# Altium schematic sheet HCHO_Benchmark.SchDoc
size A2
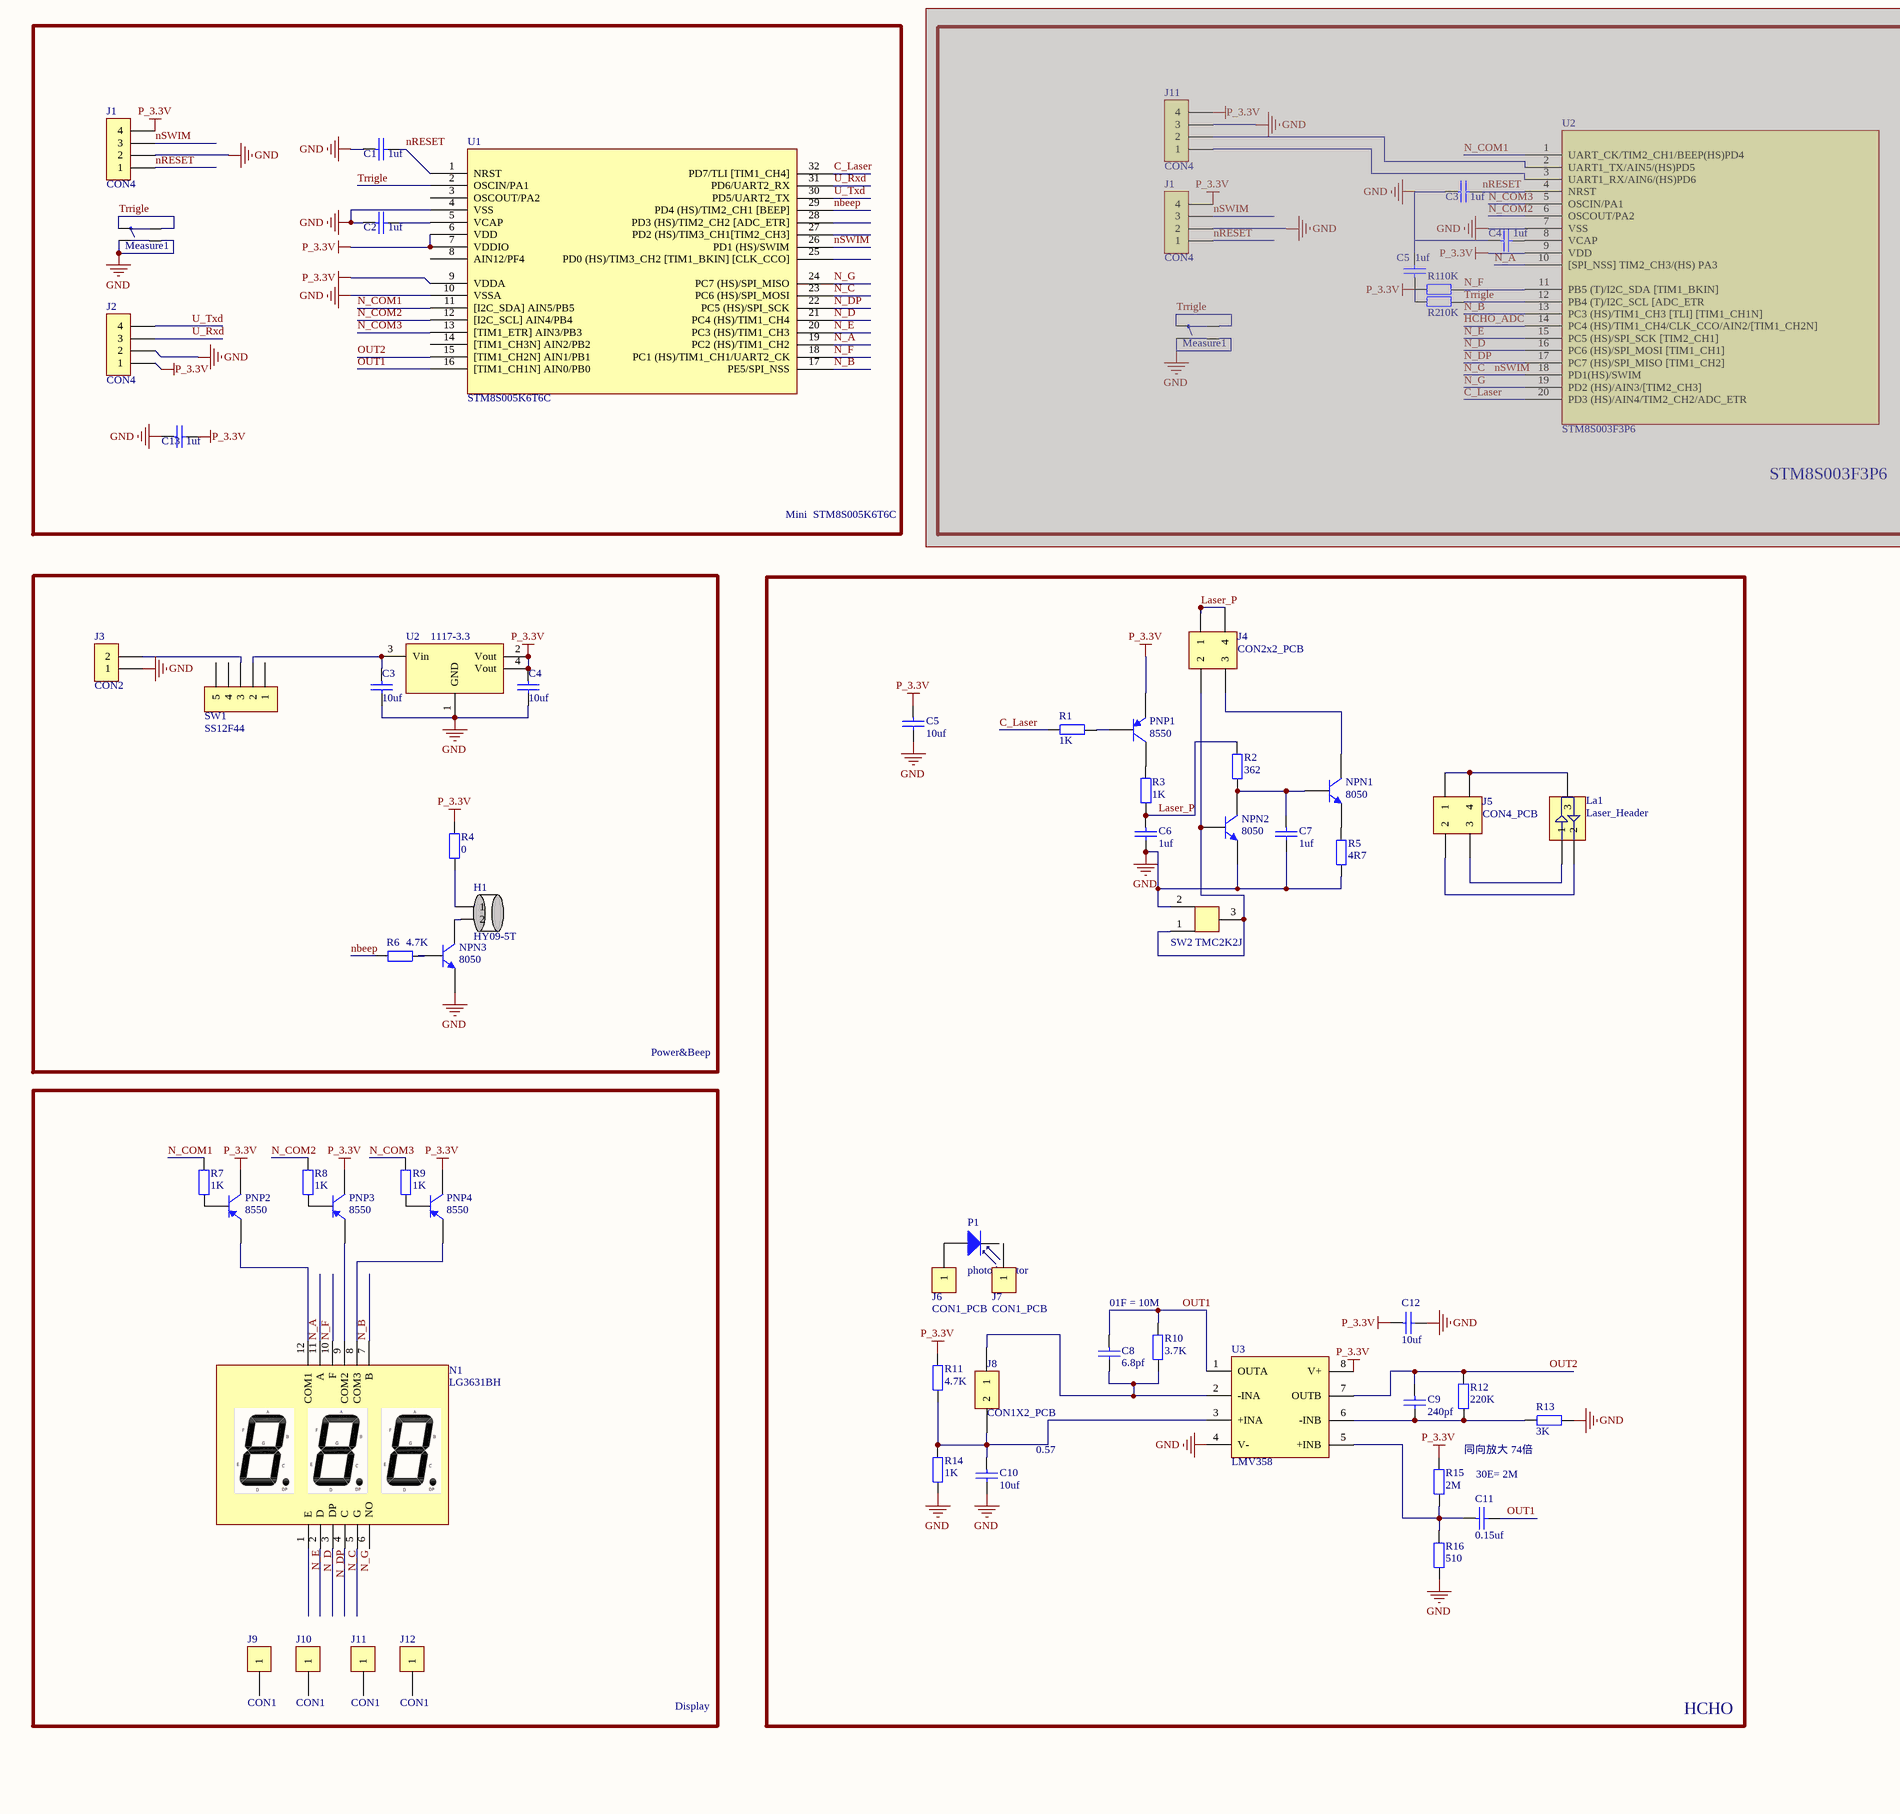
[diagram p0: HCHO_Benchmark.SchDoc, left]
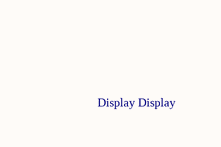
[diagram p1: HCHO_Benchmark.SchDoc, right]

## Parts
(Parts that share a designator on the sheet are numbered #1, #2 ... from top to bottom, then left to right.)
C1  1uf  [C0805]
C2  1uf  [C0805]
C3#1  1uf  [C0805]  (masked out: inside a compile mask, not in the netlist)
C3#2  10uf  [C0805]
C4#1  1uf  [C0805]  (masked out: inside a compile mask, not in the netlist)
C4#2  10uf  [C0805]
C5#1  1uf  [C0805]  (masked out: inside a compile mask, not in the netlist)
C5#2  10uf  [C0805]
C6  1uf  [C0805]
C7  1uf  [C0805]
C8  6.8pf  [C0805]
C9  240pf  [C0805]
C10  10uf  [C0805]
C11  0.15uf  [C0805]
C12  10uf  [C0805]
C13  1uf  [C0805]
H1  HY09-5T  [HY09-5T]
J1#1  CON4  [CON4]
J1#2  CON4  [CON4]  (masked out: inside a compile mask, not in the netlist)
J2  CON4  [CON4]
J3  CON2  [CON2]
J4  CON2x2_PCB  [CON2x2_1.6mm_PCB]
J5  CON4_PCB  [CON4_PCB]
J6  CON1_PCB  [CON1_PCB]
J7  CON1_PCB  [CON1_PCB]
J8  CON1X2_PCB  [CON1x2_1.6mm_PCB]
J9  CON1  [2.5MM]
J10  CON1  [2.5MM]
J11#1  CON4  [CON4]  (masked out: inside a compile mask, not in the netlist)
J11#2  CON1  [2.5MM]
J12  CON1  [2.5MM]
La1  Laser_Header  [Laser_Header]
Measure1#1  Patch_6x6x5  [Patch6x6x5]  (value not drawn)
Measure1#2  Patch_6x6x5  [Patch6x6x5]  (value not drawn)  (masked out: inside a compile mask, not in the netlist)
N1  LG3631BH  [LG3631BH]
NPN1  8050  [SOT23-3]
NPN2  8050  [SOT23-3]
NPN3  8050  [SOT23-3]
P1  photodetector  [BPW34]
PNP1  8550  [SOT23-3]
PNP2  8550  [SOT23-3]
PNP3  8550  [SOT23-3]
PNP4  8550  [SOT23-3]
R1#1  10K  [R0805]  (masked out: inside a compile mask, not in the netlist)
R1#2  1K  [R0805]
R2#1  10K  [R0805]  (masked out: inside a compile mask, not in the netlist)
R2#2  362  [R0805]
R3  1K  [R0805]
R4  0  [R0805]
R5  4R7  [R0805]
R6  4.7K  [R0805]
R7  1K  [R0805]
R8  1K  [R0805]
R9  1K  [R0805]
R10  3.7K  [R0805]
R11  4.7K  [R0805]
R12  220K  [R0805]
R13  3K  [R0805]
R14  1K  [R0805]
R15  2M  [R0805]
R16  510  [R0805]
SW1  SS12F44  [SS12F44]
SW2  TMC2K2J  [TMC2K2J]
U1  STM8S005K6T6C  [STM8S005K6T6C]
U2#1  STM8S003F3P6  [STM8S003F3P6]  (masked out: inside a compile mask, not in the netlist)
U2#2  1117-3.3  [SOT223]
U3  LMV358  [LMV358_SOP]

## Blocks framed on the sheet
Mini  STM8S005K6T6C: C1 C2 C13 J1#1 J2 Measure1#1 U1
STM8S003F3P6: C3#1 C4#1 C5#1 J1#2 J11#1 Measure1#2 R1#1 R2#1 U2#1
Power&Beep: C3#2 C4#2 H1 J3 NPN3 R4 R6 SW1 U2#2
HCHO: C5#2 C6-C12 J4-J8 La1 NPN1 NPN2 P1 PNP1 R1#2 R2#2 R3 R5 R10-R16 SW2 U3
Display: J9 J10 J11#2 J12 N1 PNP2-PNP4 R7-R9

## Nets
GND: C1.1 C2.1 C3#2.2 C4#2.2 C5#2.2 C6.2 C7.2 C10.2 C12.2 C13.1 J1#1.2 J2.2 J3.1 Measure1#1.3 Measure1#1.4 NPN2.2(E) NPN3.2(E) R5.1 R13.1 R14.1 R16.1 SW2.2 U1.4(VSS) U1.10(VSSA) U2#2.1(GND) U3.4(V-)
P_3.3V: C4#2.1 C5#2.1 C12.1 C13.2 J1#1.4 J2.1 PNP1.2(E) PNP2.3(C) PNP3.3(C) PNP4.3(C) R4.2 R11.2 R15.2 U1.6(VDD) U1.7(VDDIO) U1.9(VDDA) U2#2.2(Vout) U2#2.4(Vout) U3.8(V+)
C_Laser: R1#2.2 U1.32(PD7/TLI_[TIM1_CH4])
Laser_P: C6.1 J4.1 J4.4 R2#2.2 R3.2
N_A: N1.11(A) U1.19(PC2_(HS)/TIM1_CH2)
N_B: N1.7(B) U1.17(PE5/SPI_NSS)
N_C: N1.4(C) U1.23(PC6_(HS)/SPI_MOSI)
N_COM1: R7.2 U1.11([I2C_SDA]_AIN5/PB5)
N_COM2: R8.2 U1.12([I2C_SCL]_AIN4/PB4)
N_COM3: R9.2 U1.13([TIM1_ETR]_AIN3/PB3)
N_D: N1.2(D) U1.21(PC4_(HS)/TIM1_CH4)
N_DP: N1.3(DP) U1.22(PC5_(HS)/SPI_SCK)
N_E: N1.1(E) U1.20(PC3_(HS)/TIM1_CH3)
N_F: N1.10(F) U1.18(PC1_(HS)/TIM1_CH1/UART2_CK)
N_G: N1.5(G) U1.24(PC7_(HS)/SPI_MISO)
nbeep: R6.1 U1.29(PD4_(HS)/TIM2_CH1_[BEEP])
nRESET: C1.2 J1#1.1 U1.1(NRST)
nSWIM: J1#1.3 U1.26(PD1_(HS)/SWIM)
OUT1: C8.1 C11.2 R10.2 U1.16([TIM1_CH1N]_AIN0/PB0) U3.1(OUTA)
OUT2: C9.1 R12.2 U1.15([TIM1_CH2N]_AIN1/PB1) U3.7(OUTB)
Trrigle: Measure1#1.1 Measure1#1.2 U1.2(OSCIN/PA1)
U_Rxd: J2.3 U1.31(PD6/UART2_RX)
U_Txd: J2.4 U1.30(PD5/UART2_TX)
NetC2_2: C2.2 U1.5(VCAP)
NetC3#2_1: C3#2.1 SW1.2 U2#2.3(Vin)
NetC7_1: C7.1 NPN1.1(B) NPN2.3(C) R2#2.1
NetC8_2: C8.2 J8.1 R10.1 U3.2(-INA)
NetC9_2: C9.2 R12.1 R13.2 U3.6(-INB)
NetC10_1: C10.1 J8.2 R11.1 R14.2 U3.3(+INA)
NetC11_1: C11.1 R15.1 R16.2 U3.5(+INB)
NetH1_1: H1.1 R4.1
NetH1_2: H1.2 NPN3.3(C)
NetJ3_2: J3.2 SW1.3
NetJ4_2: J4.2 NPN2.1(B) SW2.1 SW2.3
NetJ4_3: J4.3 NPN1.3(C)
NetJ5_1: J5.1 J5.4 La1.3
NetJ5_2: J5.2 La1.2
NetJ5_3: J5.3 La1.1
NetJ6_1: J6.1 P1.A
NetN1_8: N1.8(COM3) PNP4.2(E)
NetN1_9: N1.9(COM2) PNP3.2(E)
NetN1_12: N1.12(COM1) PNP2.2(E)
NetNPN1_2: NPN1.2(E) R5.2
NetNPN3_1: NPN3.1(B) R6.2
NetPNP1_1: PNP1.1(B) R1#2.1
NetPNP1_3: PNP1.3(C) R3.1
NetPNP2_1: PNP2.1(B) R7.1
NetPNP3_1: PNP3.1(B) R8.1
NetPNP4_1: PNP4.1(B) R9.1

Not connected (* = marked no-connect by the designer): J7 1; J9 1; J10 1; J11#2 1; J12 1; N1 6(NO); P1 C(K); SW1 1 4 5; U1 3(OSCOUT/PA2) 8(AIN12/PF4) 14([TIM1_CH3N]_AIN2/PB2) 25(PD0_(HS)/TIM3_CH2_[TIM1_BKIN]_[CLK_CCO]) 27(PD2_(HS)/TIM3_CH1[TIM2_CH3]) 28(PD3_(HS)/TIM2_CH2_[ADC_ETR])

## Notes on the sheet
- 01F = 10M
- 0.57
- 同向放大 74倍
- 30E= 2M
- Display

## Library data of the parts
C1 C2 C3#1 C3#2 C4#1 C4#2 C5#1 C5#2 C6-C13 = C: Attributes: 10V 20%  Non polar capacitor
H1 = HY09-5T: Purchase: C2857; Attributes: *; Prices: 0.46
J9 J10 J11#2 J12 = CON1: Attributes: 2.54; Purchase: *
La1 = Laser_Header: Purchase: 温桂仙 234752466; Prices: 4.00; Attributes: *
Measure1#1 Measure1#2 = Patch_6x6x5: Purchase: C8212; Attributes: *; Prices: 0.0406
NPN1-NPN3 = NPN: Purchase: C2146; Attributes: *; Prices: 0.05
P1 = photodetector: Purchase: C5149; Attributes: *; Prices: 2.70
PNP1-PNP4 = PNP: Purchase: C2147; Attributes: *; Prices: 0.04
R1#1 R1#2 R2#1 R2#2 R3 R5 R7-R16 = R: Attributes: 5% Stacked resistance
R4 R6 = RES1
  R4: Value: 0
  R6: Value: 4.7K
U1 = STM8S005K6T6C: Purchase: C37925; Prices: 2.41; Attributes: *
U2#1 = STM8S003F3P6: Purchase: C18615; Attributes: *; Prices: 1.26
U2#2 = 1117: Attributes: LDO 800ma; Purchase: C6186; Prices: 0.38
U3 = LMV358: Purchase: C7980; Attributes: *; Prices: 0.50
J1#1 J1#2 J2 J11#1 = CON4: Attributes: *
J3 = CON2: Attributes: *
N1 = LG3631BH: Prices: 1.35; Purchase: http://item.taobao.com/item.htm?spm=a230r.1.14.1.KJjqmE&id=3944807830&ns=1&abbucket=19#detail; Attributes: *
SW1 = SS12F44: Purchase: https://item.taobao.com/item.htm?spm=a230r.1.14.151.UkbYgq&id=38597938820&ns=1&abbucket=10#detail&qq-pf-to=pcqq.c2c; Attributes: *; Prices: 0.08
SW2 = TMC2K2J: Purchase: http://item.taobao.com/item.htm?spm=a230r.1.14.59.T7OLRv&id=40257113019&ns=1&_u=imljuuh77dc&abbucket=9#detail; Prices: 0.16; Attributes: *